# EAGLE design alimentare_no_ac (EAGLE 6.6.0)
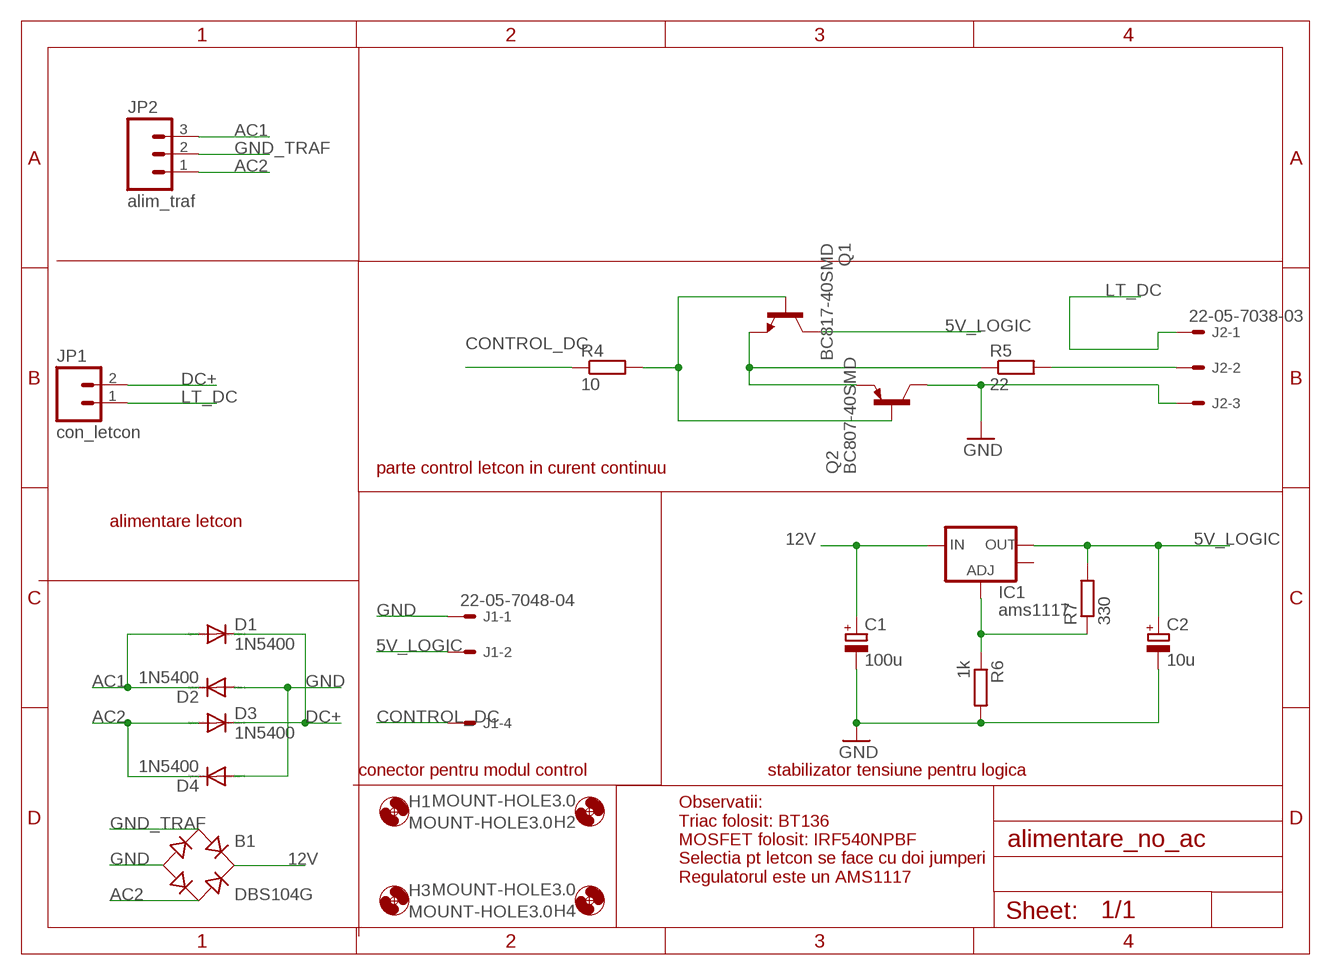
[diagram p0: schematic, sheet 1]

## Parts
B1  DBS104G  [DBS]
C1  100u  CPOL-EUE2,5-6E  [E2,5-6E]
C2  10u  CPOL-EUE2,5-6E  [E2,5-6E]
D1  1N5400  [DO201-15]
D2  1N5400  [DO201-15]
D3  1N5400  [DO201-15]
D4  1N5400  [DO201-15]
H1  MOUNT-HOLE3.0  [3,0]
H2  MOUNT-HOLE3.0  [3,0]
H3  MOUNT-HOLE3.0  [3,0]
H4  MOUNT-HOLE3.0  [3,0]
IC1  ams1117  V_REG_LM1117SOT223  [SOT223]
J1  22-05-7048-04  [7395-04]
J2  22-05-7038-03  [7395-03]
JP1  con_letcon  M023.5MM  [SCREWTERMINAL-3.5MM-2]
JP2  alim_traf  M03SCREW  [SCREWTERMINAL-3.5MM-3]
Q1  BC817-40SMD  [SOT23-BEC]
Q2  BC807-40SMD  [SOT23-BEC]
R4  10  R-EU_M1206  [M1206]
R5  22  R-EU_M1206  [M1206]
R6  1k  R-EU_M1206  [M1206]
R7  330  R-EU_M1206  [M1206]

## Nets
5V_LOGIC: C2.+ IC1.2(OUT) J1.2 Q1.C R7.2
12V: B1.+ C1.+ IC1.3(IN)
AC1: D1.A D2.C JP2.3
AC2: B1.AC2 D3.A D4.C JP2.1
CONTROL_DC: J1.4 R4.1
DC+: D1.C D3.C JP1.2
GND: B1.- C1.- C2.- D2.A D4.A J1.1 J2.3 Q2.C R6.2
GND_TRAF: B1.AC1 JP2.2
LT_DC: J2.1 JP1.1
N$1: J2.2 R5.2
N$5: Q1.E Q2.E R5.1
N$7: Q1.B Q2.B R4.2
N$10: IC1.1(ADJ) R6.1 R7.1
Unconnected: IC1.4(OUT) J1.3

## Notes on the sheet
- parte control letcon in curent continuu
- alimentare letcon
- conector pentru modul control | stabilizator tensiune pentru logica
- Observatii:
  Triac folosit: BT136
  MOSFET folosit: IRF540NPBF
  Selectia pt letcon se face cu doi jumperi
  Regulatorul este un AMS1117

## Library data of the parts
B1 = rectifier:DB?*G: Single Phase 1.0 AMP Glass Passivated Bridge Rectifier Taiwan Semiconductor Co.,Ltd. - TSC Source: http://www.taiwansemi.com/TSCbig5/ezcatfiles/cust/img/img/db101g.pdf http://www.ts.com.tw/db/pictures/modules/PDT/PDT060207001/DBLS201G.pdf
C1 C2 = resistor:CPOL-EU: POLARIZED CAPACITOR, European symbol
D1-D4 = diode:1N5400: DIODE standard rectifier, 3 A, 50 V (Motorola)
H1-H4 = holes:MOUNT-HOLE: MOUNTING HOLE with drill center marker
IC1 = SparkFun-PowerIC:V_REG_LM1117: Voltage Regulator LM1117 Standard adjustable voltage regulator but in SMD form. Spark Fun Electronics SKU : COM-00595
J1 = con-molex:22-?-04: CONNECTOR wire to board 2.54 mm (.1 inch) pitch header; OC_FARNELL: unknown; OC_NEWARK: unknown
J2 = con-molex:22-?-03: CONNECTOR wire to board 2.54 mm (.1 inch) pitch header; OC_FARNELL: unknown; OC_NEWARK: unknown
JP1 = SparkFun-Connectors:M02: Standard 2-pin 0.1" header. Use with - straight break away headers ( PRT-00116) - right angle break away headers (PRT-00553) - swiss pins (PRT-00743) - machine pins (PRT-00117) - female headers (PRT-00115) Molex polarized connector foot print use with: PRT-08233 with associated crimp pins and housings. 2.54_SCREWTERM for use with PRT-10571. 3.5mm Screw Terminal footprints for PRT-08084 5mm Screw Terminal footprints for use with PRT-08433
JP2 = SparkFun-Connectors:M03: Header 3 Standard 3-pin 0.1" header. Use with straight break away headers (SKU : PRT-00116), right angle break away headers (PRT-00553), swiss pins (PRT-00743), machine pins (PRT-00117), and female headers (PRT-00115). Molex polarized connector foot print use with SKU : PRT-08232 with associated crimp pins and housings.
Q1 = transistor-npn:BC817*: NPN Transistor
Q2 = transistor-pnp:BC807*: PNP Transistror
R4-R7 = resistor:R-EU_: RESISTOR, European symbol

## Board
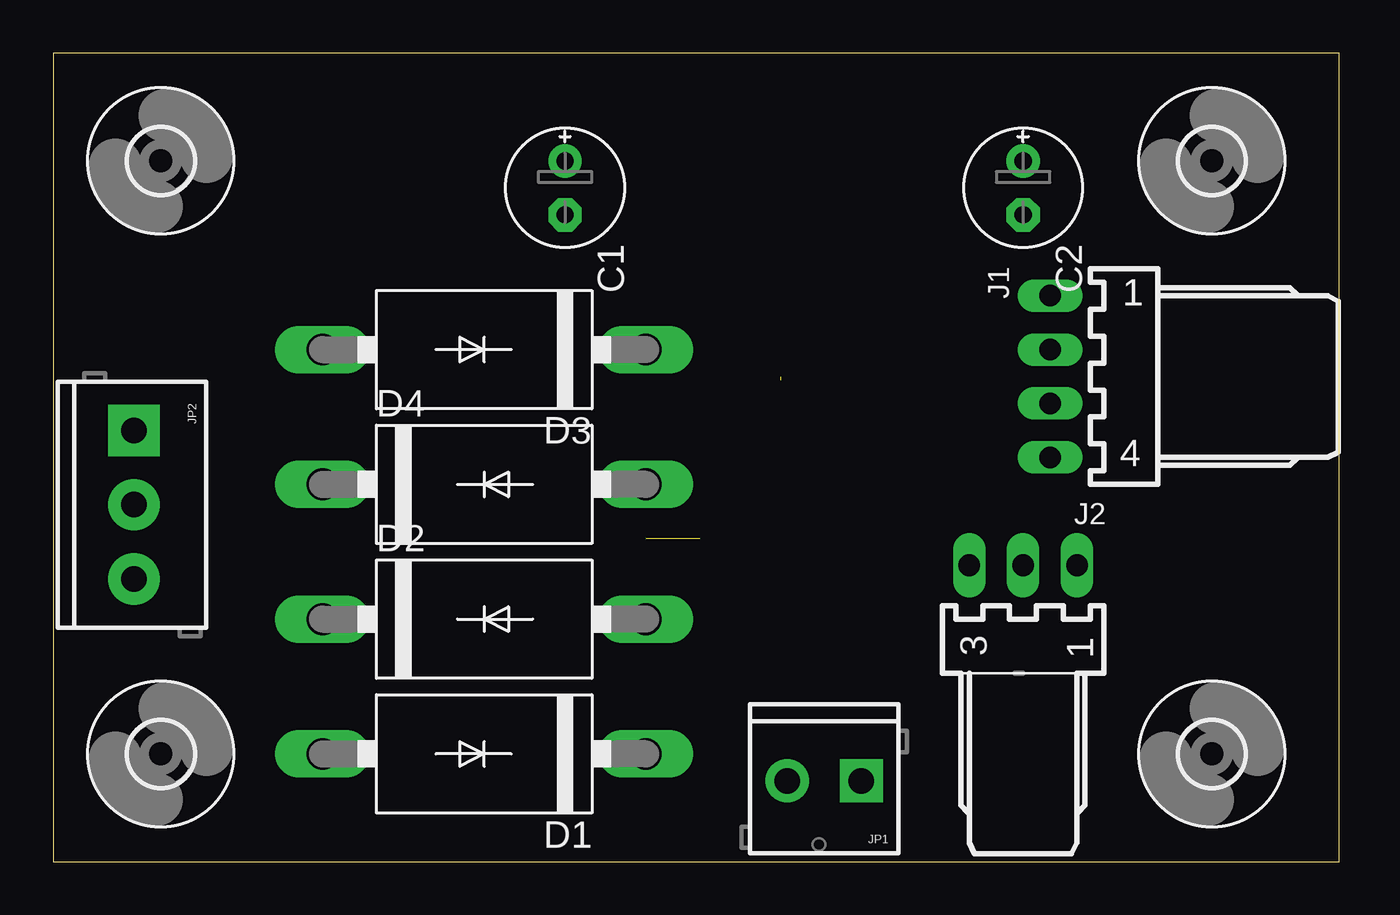
[diagram p1: board, top side]
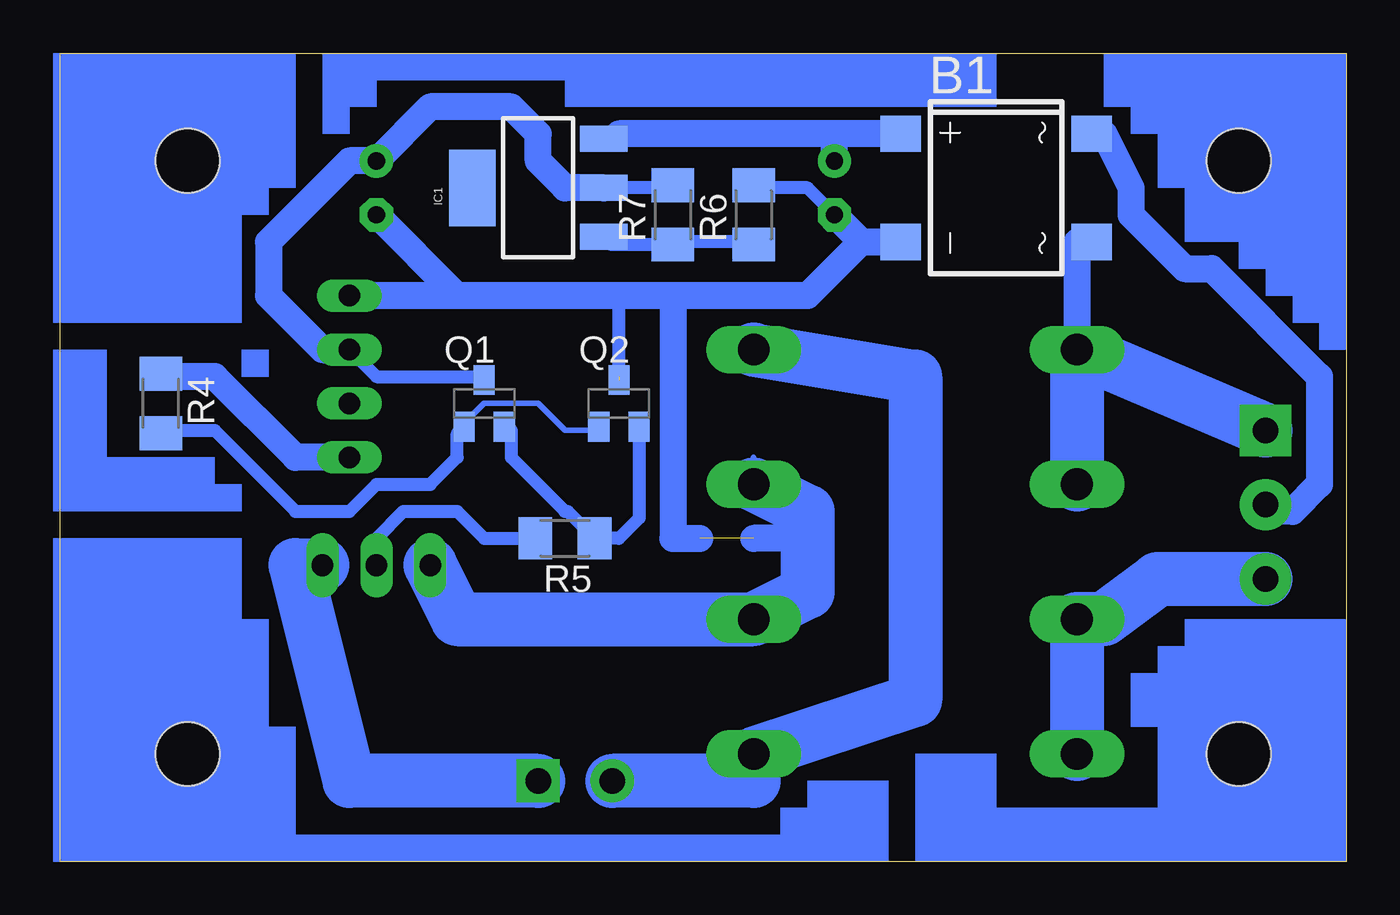
[diagram p2: board, bottom side, seen from below]

Size 60.63 x 38.09 mm. Coordinates in mm from the lower left corner, seen from the top.
Outline: 0,0 60.63,0 60.63,38.09 0,38.09 0,0
Copper layers (1*16): Top 0.035mm / dielectric 1.5mm / Bottom 0.035mm
Design rules "default": minimum track width 10mil, minimum drill 24mil, track to track 8mil, track to pad 8mil, pad to pad 8mil, via to via 8mil, smd to smd 8mil, copper to edge 40mil, drill to drill 8mil, minimum pad ring 10mil, minimum via ring 8mil, stop-mask expansion 4mil, vias tented up to drill 0mil, thermal gap 10mil

### Footprints (pad centres in the part's own frame; a part is rotated, then mirrored left to right if it is on the bottom)
DBS = smd 1.7 x 1.9: + -2.55,-4.5; - 2.55,-4.5; AC1 -2.55,4.5; AC2 2.55,4.5
E2,5-6E = drill 0.813 pad 1.575: + -1.27,0 | drill 0.813 pad 1.575 octagon: - 1.27,0
DO201-15 = drill 1.499 long: A 7.62,0; C -7.62,0
3,0 = hole 3: 0,0
SOT223 = smd 1.219 x 2.235: 1 -2.311,-3.099; 2 0,-3.099; 3 2.311,-3.099 | smd 3.6 x 2.2: 4 0,3.099
7395-04 = drill 1.016 long: 1 3.81,0; 2 1.27,0; 3 -1.27,0; 4 -3.81,0
7395-03 = drill 1.016 long: 1 2.54,0; 2 0,0; 3 -2.54,0
SCREWTERMINAL-3.5MM-2 = drill 1.2 pad 2.032 square: 1 0,0 | drill 1.2 pad 2.032: 2 3.5,0
SCREWTERMINAL-3.5MM-3 = drill 1.2 pad 2.413 square: 1 0,0 | drill 1.2 pad 2.413: 2 3.5,0; 3 7,0
SOT23-BEC = smd 1 x 1.4: B -0.95,-1.1; C 0,1.1; E 0.95,-1.1
M1206 = smd 1.6 x 2: 1 -1.4,0; 2 1.4,0

### Placement (x,y rotation side)
B1  16.51,31.75 270 bottom
C1  24.13,31.75 270 top
C2  45.72,31.75 270 top
D1  20.32,5.08 180 top
D2  20.32,11.43 0 top
D3  20.32,24.13 180 top
D4  20.32,17.78 0 top
H1  5.08,5.08 0 top
H2  5.08,33.02 0 top
H3  54.61,5.08 0 top
H4  54.61,33.02 0 top
IC1  38.1,31.75 90 bottom
J1  46.99,22.86 90 top
J2  45.72,13.97 0 top
JP1  38.1,3.81 180 top
JP2  3.81,20.32 270 top
Q1  40.64,21.59 0 bottom
Q2  34.29,21.59 0 bottom
R4  55.88,21.59 270 bottom
R5  36.83,15.24 180 bottom
R6  27.94,30.48 90 bottom
R7  31.75,30.48 90 bottom

### Tracks (layer width: path | path; a pad name or v marks a point on that pad's centre or on a via)
5V_LOGIC
  Bottom 0.254: 31.75,31.75 R7.2 | 40.64,22.86 Q1.C
  Bottom 0.61: 31.75,31.75 IC1.2 | J1.2 45.72,22.86 40.81,22.86 Q1.C
  Bottom 1.27: IC1.2 36.83,31.75 38.1,33.02 38.1,34.29 39.37,35.56 43.18,35.56 C2.+ 46.99,33.02 50.8,29.21 50.8,26.67 48.26,24.13 J1.2
12V
  Bottom 0.254: 21.59,34.29 B1.+ | 34.29,34.29 IC1.3
  Bottom 1.27: 21.59,34.29 24.13,34.29 | 24.13,34.29 34.29,34.29 | C1.+ 24.13,34.29
AC1
  Bottom 2.54: JP2.3 8.89,13.32 11.43,11.43 D2.C D1.A
AC2
  Bottom 0.254: 12.7,29.21 B1.AC2
  Bottom 1.27: 12.7,29.21 D3.A
  Bottom 2.54: JP2.1 D3.A D4.C
CONTROL_DC
  Bottom 1.27: J1.4 49.53,19.05 53.34,22.86 55.75,22.86 R4.1
DC+
  Bottom 2.54: D3.C 20.32,22.86 20.32,7.62 D1.C 27.94,3.81 JP1.2
GND  (2 unrouted)
  Bottom 0.254: 21.59,29.21 B1.- | 27.94,19.05 D4.A
  Bottom 0.61: C1.- 25.4,31.75 27.81,31.75 R6.2 | 34.29,22.86 34.29,26.67
  Bottom 1.27: C1.- 22.86,29.21 | 22.86,29.21 B1.- | 22.86,29.21 25.4,26.67 31.75,26.67 | 31.75,26.67 34.29,26.67 41.91,26.67 | 41.91,26.67 C2.- | 41.91,26.67 J1.1 | 31.75,26.67 31.75,15.24 30.48,15.24 | 25.4,15.24 27.94,15.24
  Bottom 2.54: D4.A 25.4,16.51 25.4,15.24 25.4,12.7 D2.A 41.91,11.43 J2.3
GND_TRAF
  Bottom 0.254: 11.43,34.29 B1.AC1
  Bottom 1.27: 11.43,34.29 10.16,31.75 10.16,30.48 7.62,27.94 6.35,27.94 1.27,22.86 1.27,17.78 2.54,16.51 3.5,16.51 JP2.2
LT_DC
  Bottom 2.54: JP1.1 46.99,3.81 49.53,13.97 J2.1
N$1
  Bottom 0.254: 38.1,15.24 R5.2
  Bottom 0.61: J2.2 45.72,15.24 44.45,16.51 41.91,16.51 40.64,15.24 R5.2
N$5
  Bottom 0.254: 33.02,20.32 Q2.E | 35.56,15.24 R5.1 | 39.37,20.32 Q1.E
  Bottom 0.61: 39.37,20.32 39.37,19.05 36.83,16.51 36.7,16.51 R5.1 34.29,15.24 33.34,16.19 Q2.E
N$7
  Bottom 0.254: Q2.B 35.56,20.32 36.83,20.32 38.1,21.59 40.64,21.59 41.91,20.32 Q1.B | 55.88,20.32 R4.2
  Bottom 0.61: 55.88,20.32 53.34,20.32 49.53,16.51 46.99,16.51 45.72,17.78 43.18,17.78 41.91,19.05 41.91,20.17 Q1.B
N$10
  Bottom 0.254: 27.94,29.21 R6.1 | 34.29,29.21 IC1.1 | 31.75,29.21 R7.1
  Bottom 0.61: 27.94,29.21 31.62,29.21 R7.1 34.64,29.08 IC1.1
(copper drawn outside any net)
  shapes: Bottom area x35